# EAGLE design main (EAGLE 9.3.0)
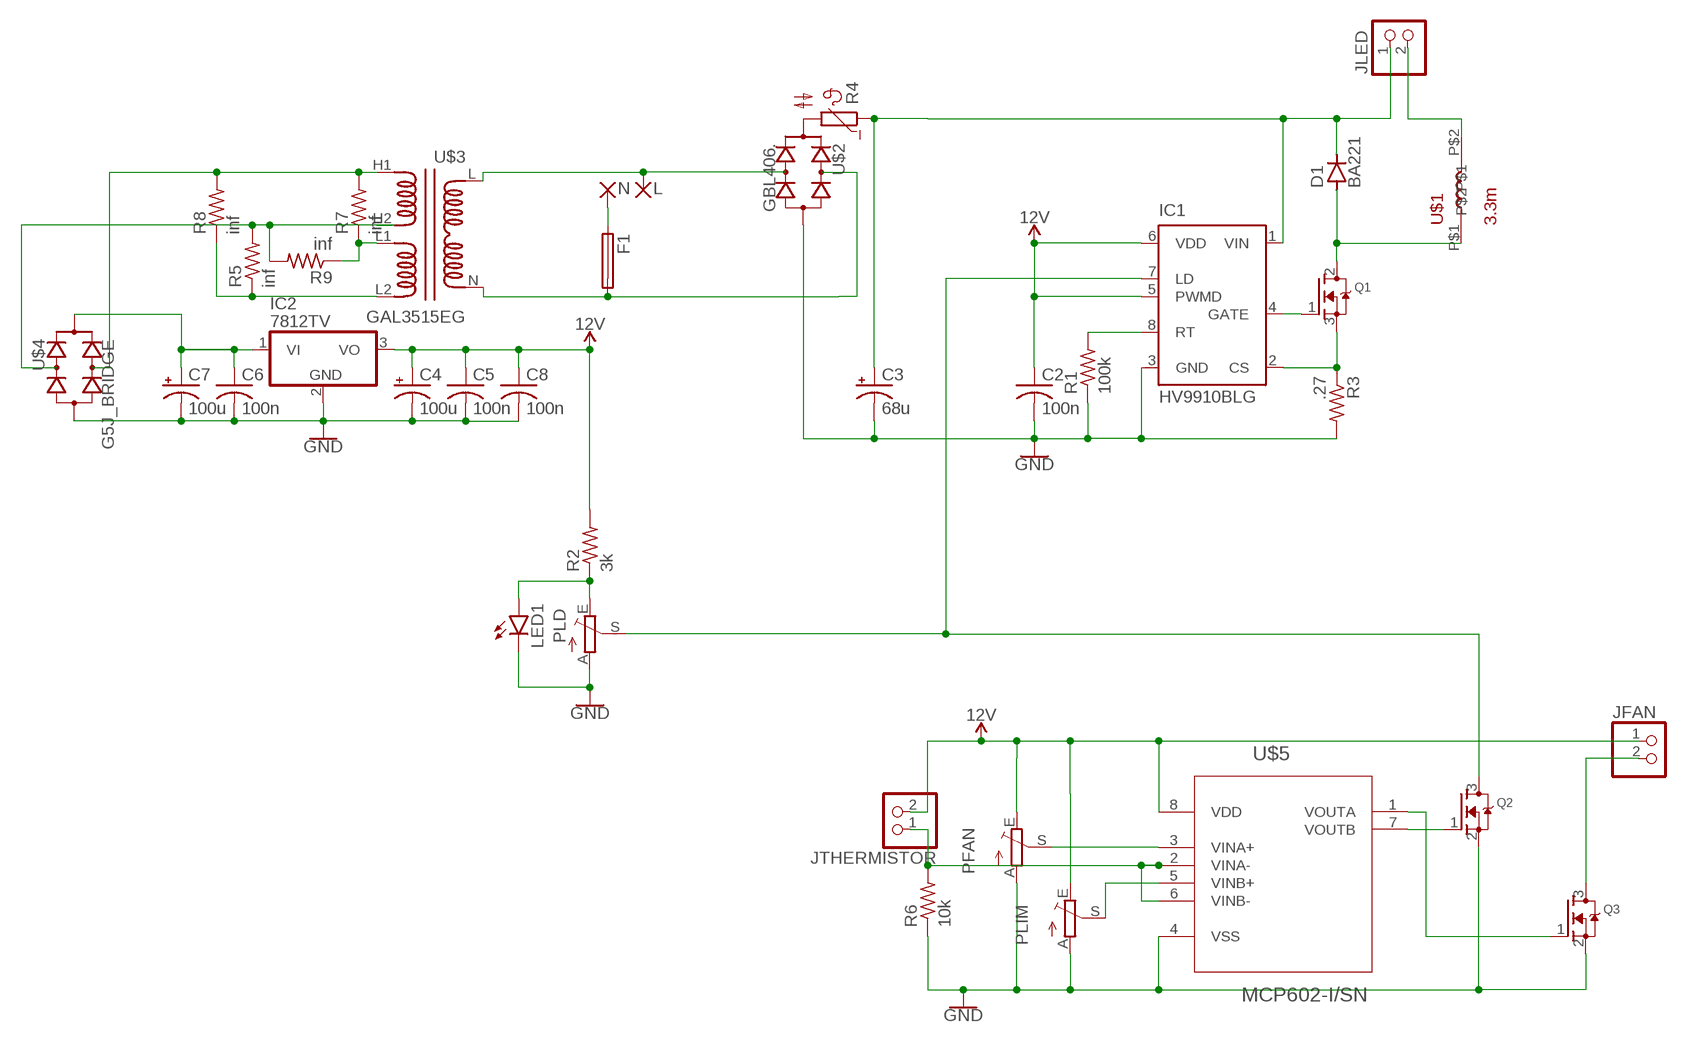
[diagram p0: schematic, sheet 1]

## Parts
C2  100n  C-USC0603  [C0603]
C3  68u  CPOL-USE7.5-16  [E7,5-16]
C4  100u  CPOL-USE3.5-8  [E3,5-8]
C5  100n  C-USC0603  [C0603]
C6  100n  C-USC0603  [C0603]
C7  100u  CPOL-USE3.5-8  [E3,5-8]
C8  100n  C-USC0603  [C0603]
D1  BA221  [DO35-10]
F1  SH22,5A  [SH22,5A]
IC1  HV9910BLG  [SOIC-08LG]
IC2  7812TV  [TO220V]
JFAN  PINHD-1X2  [1X02]
JLED  PINHD-1X2  [1X02]
JTHERMISTOR  PINHD-1X2  [1X02]
L  2,54/1,0  [2,54/1,0]
LED1  LED3MM  [LED3MM]
N  2,54/1,0  [2,54/1,0]
PFAN  TRIM_EU-B64Y  [B64Y]
PLD  TRIM_EU-B64Y  [B64Y]
PLIM  TRIM_EU-B64Y  [B64Y]
Q1  MOSFET-NGDS_TO220V  [TO220V]
Q2  MOSFET-NREFLOW  [SOT23]
Q3  MOSFET-NREFLOW  [SOT23]
R1  100k  R-US_R0603  [R0603]
R2  3k  R-US_0204/5  [0204/5]
R3  .27  R-US_0207/7  [0207/7]
R4  B57164  [B57164]
R5  inf  R-US_R0805  [R0805]
R6  10k  R-US_R0603  [R0603]
R7  inf  R-US_R0805  [R0805]
R8  inf  R-US_R0805  [R0805]
R9  inf  R-US_R0805  [R0805]
U$1  3.3m  3.3MH  [3.3MH]
U$2  GBL406.  [GBL406]
U$3  GAL3515EG  [GAL3515E]
U$4  G5J_BRIDGE  [G5J_BRIDGE]
U$5  MCP602-I/SN  [SOIC127P600X175-8N]

## Nets
12V: C2.1 C4.+ C5.1 C8.1 IC1.5(PWMD) IC1.6(VDD) IC2.3(VO) JFAN.1 JTHERMISTOR.2 PFAN.E PLIM.E R2.2 U$5.8(VDD)
CS: IC1.2(CS) Q1.3(S) R3.1
FANMINUS: JFAN.2 Q3.3(D)
FFAN: Q3.1(G) U$5.1(VOUTA)
FLED: Q2.1(G) U$5.7(VOUTB)
GATE: IC1.4(GATE) Q1.1(G)
GND: C2.2 C3.- C4.- C5.2 C6.2 C7.- C8.2 IC1.3(GND) IC2.2(GND) LED1.K(C) PFAN.A PLD.A PLIM.A Q2.2(S) Q3.2(S) R1.1 R3.2 R6.1 U$2.- U$4.- U$5.4(VSS)
H1: R7.2 R8.2 U$3.H1 U$4.AC2(AC)
H2: R5.2 R9.2 U$3.H2 U$4.AC1(AC)
L: L.1(P) U$2.AC@2(AC) U$3.L
LD: IC1.7(LD) PLD.S Q2.3(D)
N: F1.2 U$2.AC@1(AC) U$3.N
N$1: D1.A Q1.2(D) U$1.P$1
N$2: R4.2 U$2.+
N$3: IC1.8(RT) R1.2
N$4: F1.1 N.1(P)
N$5: LED1.A PLD.E R2.1
N$6: JLED.2 U$1.P$2
N$7: PFAN.S U$5.3(VINA+)
N$8: R7.1 R9.1 U$3.L1
N$9: JTHERMISTOR.1 R6.2 U$5.2(VINA-) U$5.6(VINB-)
N$11: R5.1 R8.1 U$3.L2
N$14: C6.1 C7.+ IC2.1(VI) U$4.+
SETFAULT: PLIM.S U$5.5(VINB+)
V+: C3.+ D1.C IC1.1(VIN) JLED.1 R4.1

## Library data of the parts
C2 C5 C6 C8 = rcl:C-US: CAPACITOR, American symbol; SPICEPREFIX: C
C3 C4 C7 = rcl:CPOL-US: POLARIZED CAPACITOR, American symbol; SPICEPREFIX: C
D1 = diode:BA221: DIODE high speed (Philips)
F1 = fuse:SH22,5A: FUSE HOLDER grid 22,5mm, isolated cap OGN0031 8201, Schurter (Buerklin); MPN: 0031.7701.11; OC_FARNELL: unknown; OC_NEWARK: 04F1224
IC1 = supertex:HV9910B: Universal High Brightness LED Driver Source: www.supertex.com .. led_driver_ics_SG.pdf; MPN: MXHV9910B; OC_FARNELL: unknown; OC_NEWARK: 15R9731
IC2 = linear:78*: Positive VOLTAGE REGULATOR Source: http://cache.national.com/ds/LM/LM78L05.pdf http://www.fairchildsemi.com/ds/LM/LM7805.pdf
JFAN JLED JTHERMISTOR = pinhead:PINHD-1X2: PIN HEADER
L N = 7_segment_lib:2,54/1,0: THROUGH-HOLE PAD
LED1 = led:LED: LED OSRAM: - CHIPLED LG R971, LG N971, LY N971, LG Q971, LY Q971, LO R971, LY R971 LH N974, LH R974 LS Q976, LO Q976, LY Q976 LO Q996 - Hyper CHIPLED LW Q18S LB Q993, LB Q99A, LB R99A - SideLED LS A670, LO A670, LY A670, LG A670, LP A670 LB A673, LV A673, LT A673, LW A673 LH A674 LY A675 LS A676, LA A676, LO A676, LY A676, LW A676 LS A679, LY A679, LG A679 - Hyper Micro SIDELED® LS Y876, LA Y876, LO Y876, LY Y876 LT Y87S - SmartLED LW L88C, LW L88S LB L89C, LB L89S, LG L890 LS L89K, LO L89K, LY L89K LS L896, LA L896, LO L896, LY L896 - TOPLED LS T670, LO T670, LY T670, LG T670, LP T670 LSG T670, LSP T670, LSY T670, LOP T670, LYG T670 LG T671, LOG T671, LSG T671 LB T673, LV T673, LT T673, LW T673 LH T674 LS T676, LA T676, LO T676, LY T676, LB T676, LH T676, LSB T676, LW T676 LB T67C, LV T67C, LT T67C, LS T67K, LO T67K, LY T67K, LW E67C LS E67B, LA E67B, LO E67B, LY E67B, LB E67C, LV E67C, LT E67C LW T67C LS T679, LY T679, LG T679 LS T770, LO T770, LY T770, LG T770, LP T770 LB T773, LV T773, LT T773, LW T773 LH T774 LS E675, LA E675, LY E675, LS T675 LS T776, LA T776, LO T776, LY T776, LB T776 LHGB T686 LT T68C, LB T68C - Hyper Mini TOPLED® LB M676 - Mini TOPLED Santana® LG M470 LS M47K, LO M47K, LY M47K Source: http://www.osram.convergy.de LUXEON: - LUMILED® LXK2-PW12-R00, LXK2-PW12-S00, LXK2-PW14-U00, LXK2-PW14-V00 LXK2-PM12-R00, LXK2-PM12-S00, LXK2-PM14-U00 LXK2-PE12-Q00, LXK2-PE12-R00, LXK2-PE12-S00, LXK2-PE14-T00, LXK2-PE14-U00 LXK2-PB12-K00, LXK2-PB12-L00, LXK2-PB12-M00, LXK2-PB14-N00, LXK2-PB14-P00, LXK2-PB14-Q00 LXK2-PR12-L00, LXK2-PR12-M00, LXK2-PR14-Q00, LXK2-PR14-R00 LXK2-PD12-Q00, LXK2-PD12-R00, LXK2-PD12-S00 LXK2-PH12-R00, LXK2-PH12-S00 LXK2-PL12-P00, LXK2-PL12-Q00, LXK2-PL12-R00 Source: www.luxeon.com KINGBRIGHT: KA-3528ASYC Source: www.kingbright.com
PFAN PLD PLIM = pot:TRIM_EU-: POTENTIOMETER
Q1-Q3 = adafruit:MOSFET-N: N-Channel Mosfet 2N7002E - 60V 260mA SOT23 [Digikey: 2N7002ET1GOSTR-ND] - REEL BSH103 - 30V 850mA SOT23 [Digikey: 568-5013-1-ND]
R1-R3 R5-R9 = rcl:R-US_: RESISTOR, American symbol; SPICEPREFIX: R
R4 = ptc-ntc:B57164: SIEMENS NTC; MPN: B57164K474K52; OC_FARNELL: 9753451; OC_NEWARK: 29M3118
U$1 = 7_segment_lib:3.3MH
U$2 = 7_segment_lib:GBL406
U$3 = 7_segment_lib:GAL3515E
U$4 = 7_segment_lib:G5J_BRIDGE
U$5 = Microchip_By_element14_Batch_1:MCP602-I/SN: CMOS Op Amp; MPN: MCP602-I/SN; OC_FARNELL: 9758666; OC_NEWARK: 12C1813;; PACKAGE: SOIC-8; SUPPLIER: Microchip

## Board
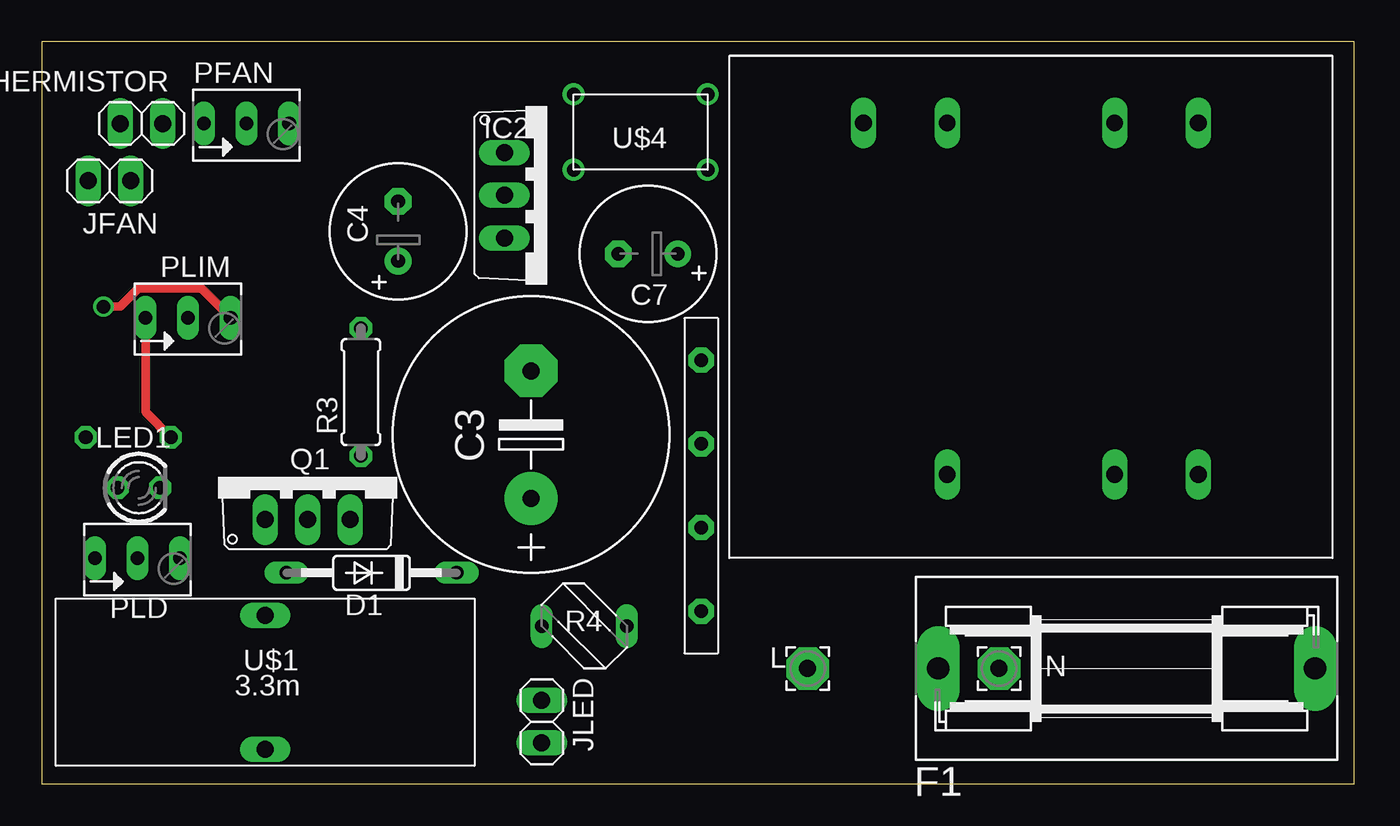
[diagram p1: board, top side]
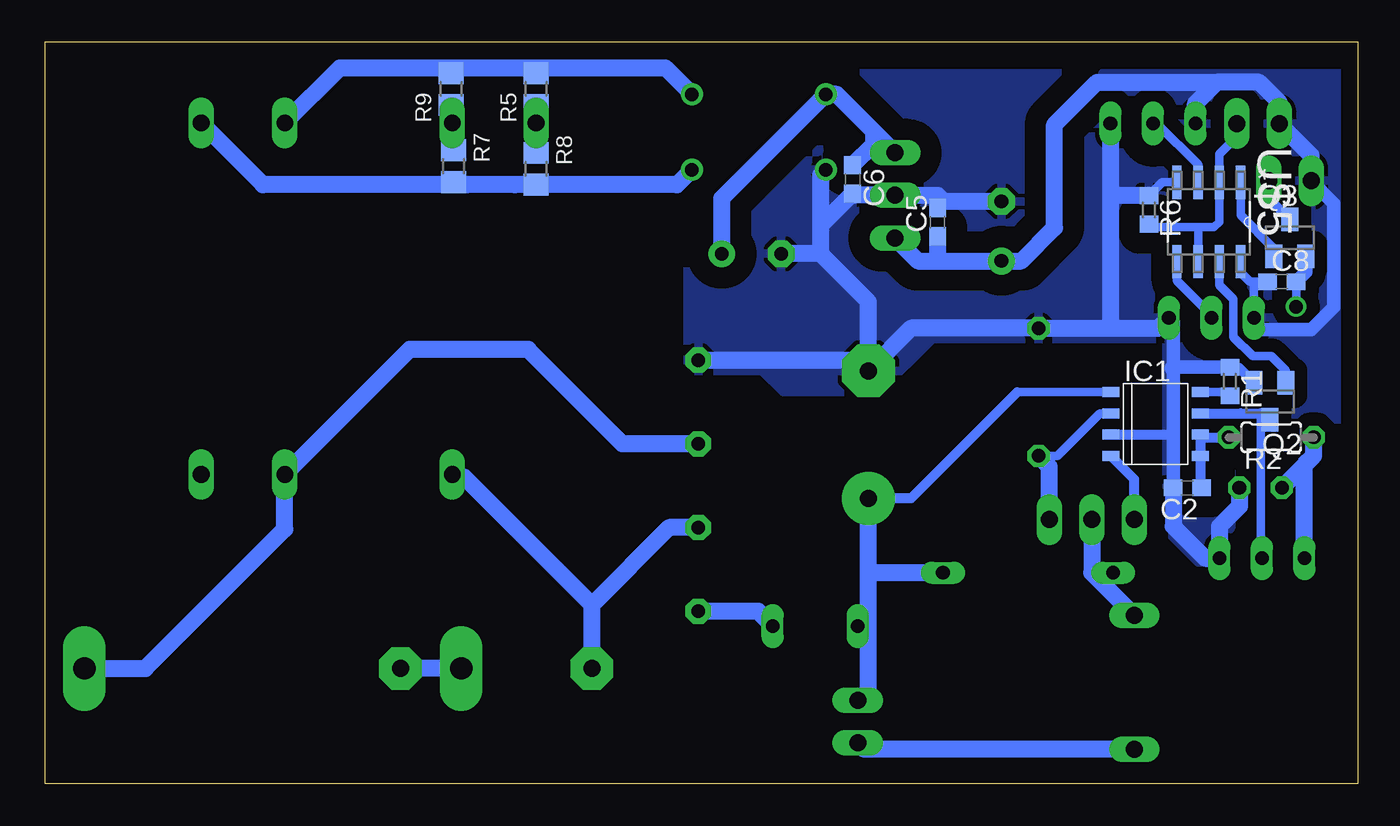
[diagram p2: board, bottom side, seen from below]

Size 78.36 x 44.31 mm. Coordinates in mm from the lower left corner, seen from the top.
Outline: 0,0 78.36,0 78.36,44.31 0,44.31 0,0
Copper layers (1*16): Top 0.035mm / dielectric 1.5mm / Bottom 0.035mm
Design rules "default": minimum track width 6mil, minimum drill 0.35mm, track to track 6mil, track to pad 6mil, pad to pad 6mil, via to via 6mil, smd to smd 6mil, copper to edge 40mil, drill to drill 6mil, minimum pad ring 10mil, minimum via ring 8mil, stop-mask expansion 4mil, vias tented up to drill 0mil, thermal gap 10mil

### Footprints (pad centres in the part's own frame; a part is rotated, then mirrored left to right if it is on the bottom)
C0603 = smd 1.1 x 1: 1 -0.85,0; 2 0.85,0
E7,5-16 = drill 1.016 pad 3.15: + -3.81,0 | drill 1.016 pad 3.15 octagon: - 3.81,0
E3,5-8 = drill 0.813 pad 1.6: + -1.778,0 | drill 0.813 pad 1.6 octagon: - 1.778,0
DO35-10 = drill 0.813 long: A 5.08,0; C -5.08,0
SH22,5A = drill 1.321 pad 2.54 long: 1 -11.252,0; 2 11.252,0
SOIC-08LG = smd 0.6 x 1: 1 -1.905,-2.675; 2 -0.635,-2.675; 3 0.635,-2.675; 4 1.905,-2.675; 5 1.905,2.675; 6 0.635,2.675; 7 -0.635,2.675; 8 -1.905,2.675
TO220V = drill 1.016 long: 1 -2.54,-2.54; 2 0,-2.54; 3 2.54,-2.54
1X02 = drill 1.016 long: 1 -1.27,0; 2 1.27,0
2,54/1,0 = drill 1.016 pad 2.54 octagon: 1 0,0
LED3MM = drill 0.813 octagon: A -1.27,0; K 1.27,0
B64Y = drill 0.813 long: A 2.54,0; E -2.54,0; S 0,0
SOT23 = smd 1 x 1.4: 1 -0.95,-1.1; 2 0.95,-1.1; 3 0,1.1
R0603 = smd 1 x 1.1: 1 -0.85,0; 2 0.85,0
0204/5 = drill 0.813 octagon: 1 -2.54,0; 2 2.54,0
0207/7 = drill 0.813 octagon: 1 -3.81,0; 2 3.81,0
B57164 = drill 0.813 long: 1 -2.54,0; 2 2.54,0
R0805 = smd 1.3 x 1.5: 1 -0.95,0; 2 0.95,0
3.3MH = drill 1 long: P$1 0,0; P$2 8,0
GBL406 = drill 0.8 pad 1.5 octagon: + 15,0; - 0,0; AC@1 5,0; AC@2 10,0
GAL3515E = drill 1 long: H1 -10,-11; H2 -5,-11; L 5,10; L1 5,-11; L2 10,-11; N -5,10; PS1 -10,10
G5J_BRIDGE = drill 0.8: + 0,0; - 4.5,0; AC1 0,8; AC2 4.5,8
SOIC127P600X175-8N = smd 1.981 x 0.559: 1 -2.362,1.905; 2 -2.362,0.635; 3 -2.362,-0.635; 4 -2.362,-1.905; 5 2.362,-1.905; 6 2.362,-0.635; 7 2.362,0.635; 8 2.362,1.905

### Placement (x,y rotation side)
C2  10.16,17.68 180 bottom
C3  29.21,20.86 90 top
C4  21.27,33 90 top
C5  25.08,33.56 90 bottom
C6  30.16,36.1 270 bottom
C7  36.2,31.66 180 top
C8  4.52,29.99 0 bottom
D1  19.69,12.61 180 top
F1  64.77,6.89 0 top
IC1  12.06,21.5 270 bottom
IC2  30.16,35.15 270 top
JFAN  4.05,36.02 0 top
JLED  29.84,3.71 270 top
JTHERMISTOR  5.95,39.43 180 top
L  45.72,6.89 0 top
LED1  5.79,17.68 0 top
N  57.15,6.89 0 top
PFAN  12.22,39.43 0 top
PLD  5.72,13.48 0 top
PLIM  8.73,27.84 0 top
Q1  15.88,18.32 0 top
Q2  5.24,22.84 180 bottom
Q3  4.05,32.61 0 bottom
R1  7.62,24.04 270 bottom
R2  5.16,20.7 180 bottom
R3  19.05,23.4 90 top
R4  32.39,9.43 0 top
R5  49.05,41.5 90 bottom
R6  12.46,34.27 270 bottom
R7  53.98,36.89 270 bottom
R8  49.05,36.73 270 bottom
R9  54.13,41.5 90 bottom
U$1  13.34,10.06 270 top
U$2  39.37,25.3 270 top
U$3  59.05,28.48 180 top
U$4  31.75,41.18 270 top
U$5  8.89,33.56 270 bottom

### Tracks (layer width: path | path; a pad name or v marks a point on that pad's centre or on a via)
12V
  Top 0.508: PLIM.E 6.19,22.21 R2.2
  Bottom 0.508: U$5.8 6.98,30.54 6.43,29.99 6.19,29.99 | 6.19,29.99 C8.1 | PLIM.E 6.19,28.08 6.19,29.99
  Bottom 0.61: C2.1 9.39,17.77 IC1.5 IC1.6 9.23,20.7 R2.2
  Bottom 0.813: JFAN.1 1.42,34.66 1.42,28.49 2.78,27.13 6.27,27.13 6.27,27.77 PLIM.E
  Bottom 1.016: JFAN.1 2.78,37.53 JTHERMISTOR.2 4.68,40.7 5.87,41.89 8.41,41.89 | PFAN.E 9.68,40.62 8.41,41.89 | IC2.3 26.24,31.23 25,31.23 | 25,31.23 C4.+ 20.08,31.23 18.1,33.21 18.1,39.35 15.56,41.89 8.41,41.89 | C5.1 25.08,31.31 25,31.23
  pour Bottom (isolate 0.813): -3.17,42.45 15.24,42.45 15.24,38.01 6.35,38.01 6.35,22.77 5.08,21.5 -4.45,21.5 -4.45,42.45
CS
  Bottom 0.508: IC1.2 15.4,22.13 17.94,19.59 R3.1
  Bottom 1.016: Q1.3 18.41,18.95 R3.1
FANMINUS
  Bottom 0.508: Q3.3 5.32,34.98 JFAN.2
FFAN
  Bottom 0.508: Q3.1 5,31.97 6.98,33.96 U$5.1
FLED
  Bottom 0.508: U$5.7 8.26,29.78 7.43,28.95 7.43,26.7 6.27,25.54 5.16,25.54 4.29,24.67 Q2.1
GATE
  Bottom 0.61: Q1.1 13.34,18.18 IC1.4
GND  (via drill 0.8)
  Top 0.508: v3.67,28.5 4.68,28.5 5.75,29.57 9.54,29.57 PLIM.A
  Bottom 0.508: U$5.4 11.66,35.92 R6.1 | C8.2 v3.67,28.5
  Bottom 0.61: 11.01,20.78 11.09,20.86 IC1.3 | Q2.2 7.13,24.89 R1.1
  Bottom 0.813: 11.01,20.78 11.01,19.99 | 11.01,19.99 C2.2 | C8.2 3.1,30.56 Q3.2 | 11.01,19.99 11.01,24.83 11.01,27.58 PLIM.A | R1.1 10.95,24.89
  Bottom 1.016: 39.23,25.44 U$2.- 29.21,25.3 C3.- | C3.- 26.67,27.21 R3.2 14.6,27.21 | C3.- 29.21,28.8 32.07,31.66 | 32.07,31.66 C7.- | 32.07,33.34 C6.2 30.06,35.15 IC2.2 25.08,35.15 | 32.07,33.34 32.07,31.66 | U$4.- 32.07,36.36 32.07,33.34 | 25.08,35.15 C5.2 | C2.2 11.01,15.38 9.1,13.48 PLD.A 8.26,15.38 7.06,16.57 LED1.K | 10.95,24.89 11.01,24.83 | 14.6,27.21 11.91,27.21 PLIM.A | PFAN.A 14.76,35.07 | 14.76,35.07 14.76,27.37 14.6,27.21 | R6.1 14.71,35.12 14.76,35.07 | C4.- 24.72,34.78 25.08,35.15
  pour Bottom (isolate 1.27, rank 2): 8.26,13.24 9.52,13.24 11.43,15.14 11.43,26.57 25.4,26.57 28.57,23.4 34.29,23.4 35.56,24.67 40.01,24.67 40.01,32.92 30.48,42.45 -5.71,42.45 -5.71,13.24
H1
  Bottom 0.508: R8.2 50.32,35.78 | R7.2 53.81,35.78 53.18,35.78
  Bottom 1.016: U$4.AC2 40.65,35.78 50.32,35.78 53.18,35.78 65.36,35.78 U$3.H1
H2
  Bottom 0.508: R5.2 49.37,42.77 | R9.2 54.13,42.77
  Bottom 1.016: U$3.H2 60.77,42.77 54.13,42.77 49.37,42.77 41.34,42.77 U$4.AC1
L
  Bottom 1.016: L.1 45.72,10.7 | 45.72,10.7 53.34,18.32 53.9,18.32 U$3.L | U$2.AC@2 41.12,15.3 45.72,10.7
LD
  Bottom 0.508: PLD.S 5.79,13.56 5.79,22.13
  Bottom 0.61: IC1.7 6.98,22.13 5.79,22.13 5.24,22.13 Q2.3
N
  Bottom 1.016: F1.2 72.39,6.89 64.06,15.23 U$3.N 56.59,25.94 49.53,25.94 43.89,20.3 U$2.AC@1
N$1
  Bottom 1.016: Q1.2 15.88,12.61 | 15.88,12.61 U$1.P$1 | D1.A 15.88,12.61
N$2
  Bottom 1.016: R4.2 35.8,10.3 U$2.+
N$3
  Bottom 0.508: R1.2 7.84,23.4 IC1.8
N$4
  Bottom 1.016: F1.1 N.1
N$5
  Bottom 1.016: LED1.A 2.62,19.59 | 2.62,19.59 R2.1 | PLD.E 3.17,19.03 2.62,19.59
N$6
  Bottom 1.016: JLED.2 29.46,2.07 U$1.P$2
N$7
  Bottom 0.508: U$5.3 9.52,36.97 11.99,39.43 PFAN.S
N$8
  Bottom 0.508: R7.1 53.98,39.4 | 53.98,39.4 U$3.L1 | R9.1 54.13,39.56 53.98,39.4
N$9
  Bottom 0.508: U$5.6 9.52,33.24 9.29,33.24 | 9.29,33.24 8.57,33.24 8.26,33.56 U$5.2 8.26,37.61 7.14,38.72 7.14,39.35 JTHERMISTOR.1 | R6.2 12.28,33.24 9.29,33.24
N$11
  Bottom 0.508: R8.1 U$3.L2 | U$3.L2 | R5.1 U$3.L2
N$14
  Bottom 1.016: C7.+ 37.97,34.96 U$4.+ 31.12,41.18 28.89,38.96 | IC2.1 28.89,38.96 | C6.1 28.89,38.22 28.89,38.96
SETFAULT
  Bottom 0.508: U$5.5 10.8,30.07 8.73,28 PLIM.S
V+
  Bottom 0.508: IC1.1 20.32,23.4
  Bottom 0.61: C3.+ 26.67,17.05 20.32,23.4
  Bottom 1.016: JLED.1 29.21,5.62 29.21,9.43 | 29.21,9.43 29.21,12.61 | 29.21,12.61 C3.+ | R4.1 29.21,9.43 | D1.C 29.21,12.61